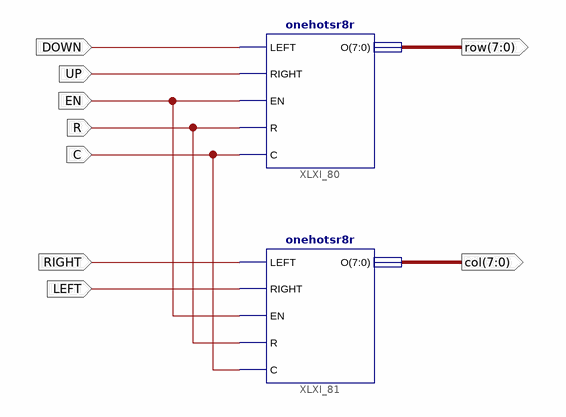
[diagram p0: schematic sheet 1]
// Xilinx ISE schematic cursor_reg.sch (spartan6) as structural Verilog: 2 symbols, 9 ports
module cursor_reg (
  input  EN,
  input  C,
  input  R,
  input  RIGHT,
  input  DOWN,
  input  UP,
  input  LEFT,
  output [7:0] col,
  output [7:0] row
);

  onehotsr8r XLXI_80 (.C(C), .EN(EN), .LEFT(DOWN), .O(row), .R(R), .RIGHT(UP));
  onehotsr8r XLXI_81 (.C(C), .EN(EN), .LEFT(RIGHT), .O(col), .R(R), .RIGHT(LEFT));
endmodule
